# EAGLE design RGB Lanyard Driver Schematic (EAGLE 9.6.2)
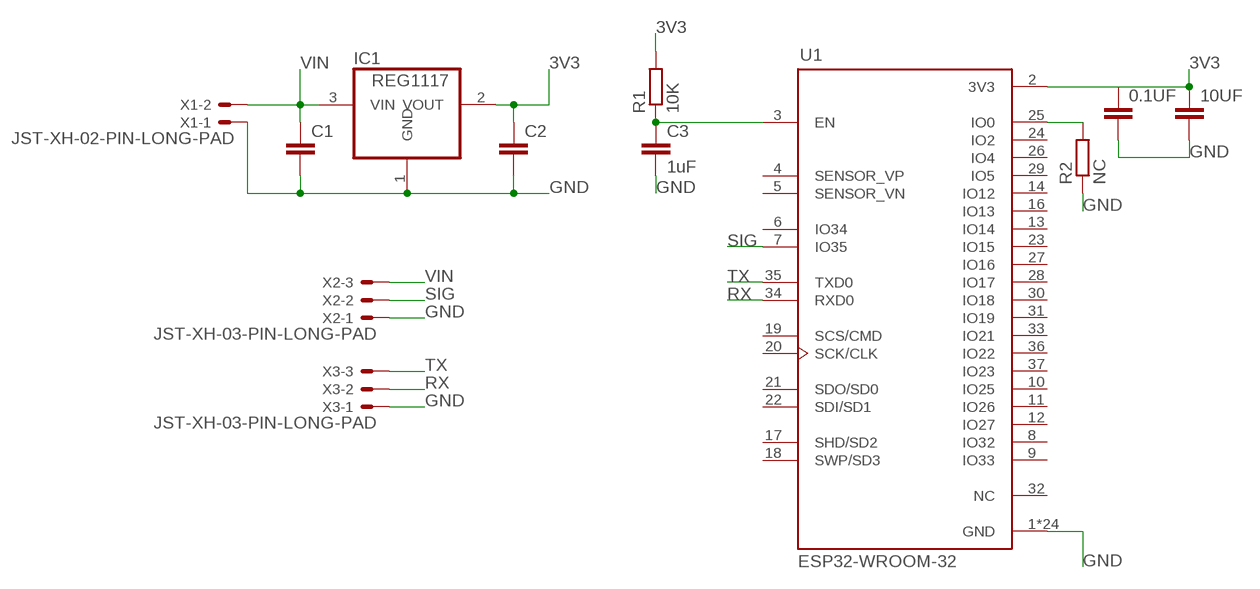
[diagram p0: schematic, sheet 1]

## Parts
0.1UF  C-EUC0805  [C0805]
10UF  C-EUC0805  [C0805]
C1  C-EUC0805  [C0805]
C2  C-EUC0805  [C0805]
C3  1uF  C-EUC0805  [C0805]
IC1  REG1117  [SOT223]
R1  10K  R-EU_R0805  [R0805]
R2  NC  R-EU_R0805  [R0805]
U1  ESP32-WROOM-32  [MODULE_ESP32-WROOM-32]
X1  JST-XH-02-PIN-LONG-PAD  [JST-XH-02-PACKAGE-LONG-PAD]
X2  JST-XH-03-PIN-LONG-PAD  [JST-XH-03-PACKAGE-LONG-PAD]
X3  JST-XH-03-PIN-LONG-PAD  [JST-XH-03-PACKAGE-LONG-PAD]

## Nets
3V3: 0.1UF.1 10UF.1 C2.1 IC1.2(VOUT) R1.2 U1.2(3V3)
GND: 0.1UF.2 10UF.2 C1.2 C2.2 C3.2 IC1.1(GND) R2.1 U1.1(GND) U1.15(GND) U1.38(GND) U1.39_1(GND) U1.39_2(GND) U1.39_3(GND) U1.39_4(GND) U1.39_5(GND) U1.39_6(GND) U1.39_7(GND) U1.39_8(GND) U1.39_9(GND) U1.39_10(GND) U1.39_11(GND) U1.39_12(GND) U1.39_13(GND) U1.39_14(GND) U1.39_15(GND) U1.39_16(GND) U1.39_17(GND) U1.39_18(GND) U1.39_19(GND) U1.39_20(GND) U1.39_21(GND) X1.1 X2.1 X3.1
N$1: C3.1 R1.1 U1.3(EN)
N$4: R2.2 U1.25(IO0)
RX: U1.34(RXD0) X3.2
SIG: U1.7(IO35) X2.2
TX: U1.35(TXD0) X3.3
VIN: C1.1 IC1.3(VIN) X1.2 X2.3
Unconnected: U1.4(SENSOR_VP) U1.5(SENSOR_VN) U1.6(IO34) U1.8(IO32) U1.9(IO33) U1.10(IO25) U1.11(IO26) U1.12(IO27) U1.13(IO14) U1.14(IO12) U1.16(IO13) U1.17(SHD/SD2) U1.18(SWP/SD3) U1.19(SCS/CMD) U1.20(SCK/CLK) U1.21(SDO/SD0) U1.22(SDI/SD1) U1.23(IO15) U1.24(IO2) U1.26(IO4) U1.27(IO16) U1.28(IO17) U1.29(IO5) U1.30(IO18) U1.31(IO19) U1.32(NC) U1.33(IO21) U1.36(IO22) U1.37(IO23)

## Library data of the parts
0.1UF 10UF C1-C3 = rcl:C-EU: CAPACITOR, European symbol; SPICEPREFIX: C
IC1 = burr-brown:REG1117: 800mA and 1A Low Dropout (LDO) Positive Regulator 1.8V, 2.5V, 2.85V, 3.3V, 5V, and Adj; MPN: REG1117; OC_FARNELL: 1097566; OC_NEWARK: 14P6981
R1 R2 = rcl:R-EU_: RESISTOR, European symbol; SPICEPREFIX: R
U1 = ESP32-WROOM-32:ESP32-WROOM-32: Check availability <https://pricing.snapeda.com/parts/ESP32-WROOM-32/Espressif%20Systems/view-part?ref=eda>; AVAILABILITY: In Stock; CHECK_PRICES: https://www.snapeda.com/parts/ESP32-WROOM-32/Espressif+Systems/view-part/?ref=eda; DESCRIPTION: Bluetooth, WiFi 802.11b/g/n, Bluetooth v4.2 +EDR, Class 1, 2 and 3 Transceiver Module 2.4GHz ~ 2.5GHz Antenna Not Included, U.FL Surface Mount; MF: Espressif Systems; MP: ESP32-WROOM-32; PACKAGE: None; PRICE: None; SNAPEDA_LINK: https://www.snapeda.com/parts/ESP32-WROOM-32/Espressif+Systems/view-part/?ref=snap
X1 = Rembrandt Electronics - JST XH Connectors v1-0:JST-XH-02-PIN: JST XH Connector 2 Pin Wire to board connector. Pitch: 2,54 mm, (0.100") Number of pins: 2 Created by Rembrandt Electronics www.rembrandtelectronics.com
X2 X3 = Rembrandt Electronics - JST XH Connectors v1-0:JST-XH-03-PIN: JST XH Connector 2 Pin Wire to board connector. Pitch: 2,54 mm, (0.100") Number of pins: 3 Created by Rembrandt Electronics www.rembrandtelectronics.com

## Board
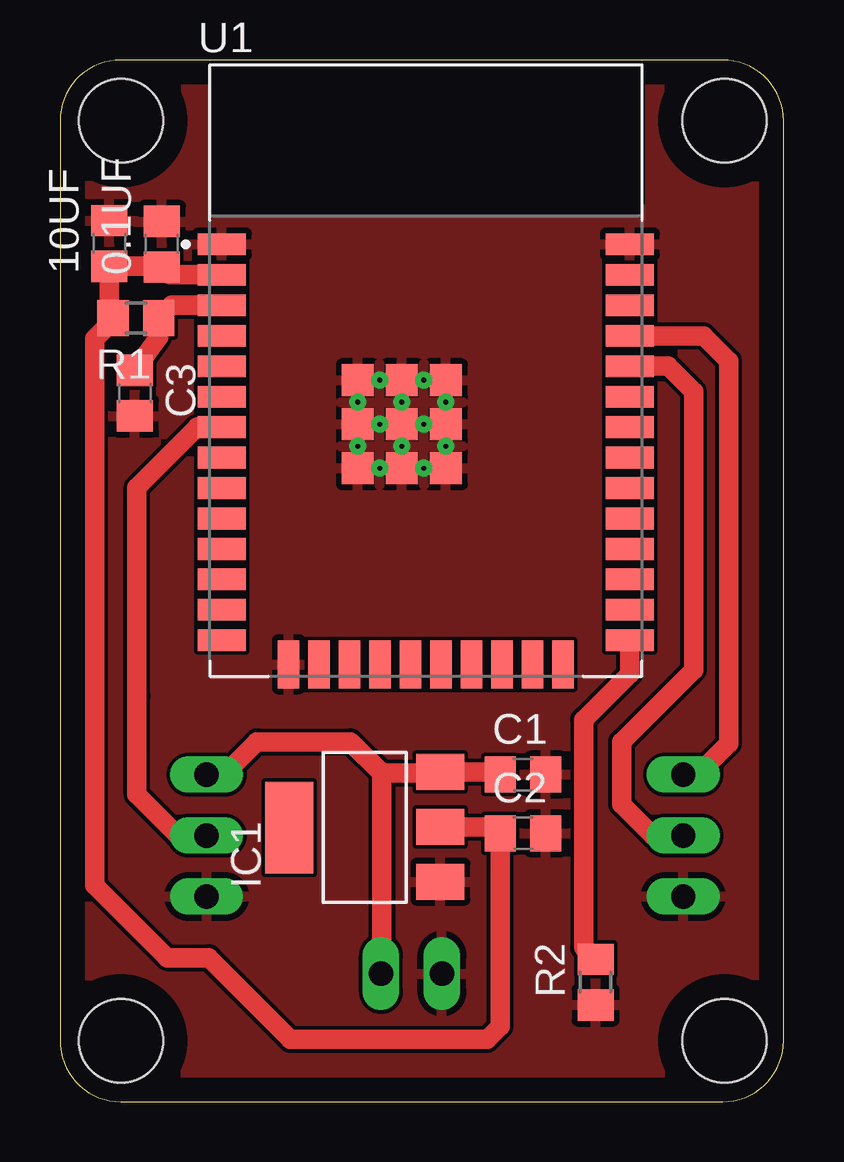
[diagram p1: board, top side]
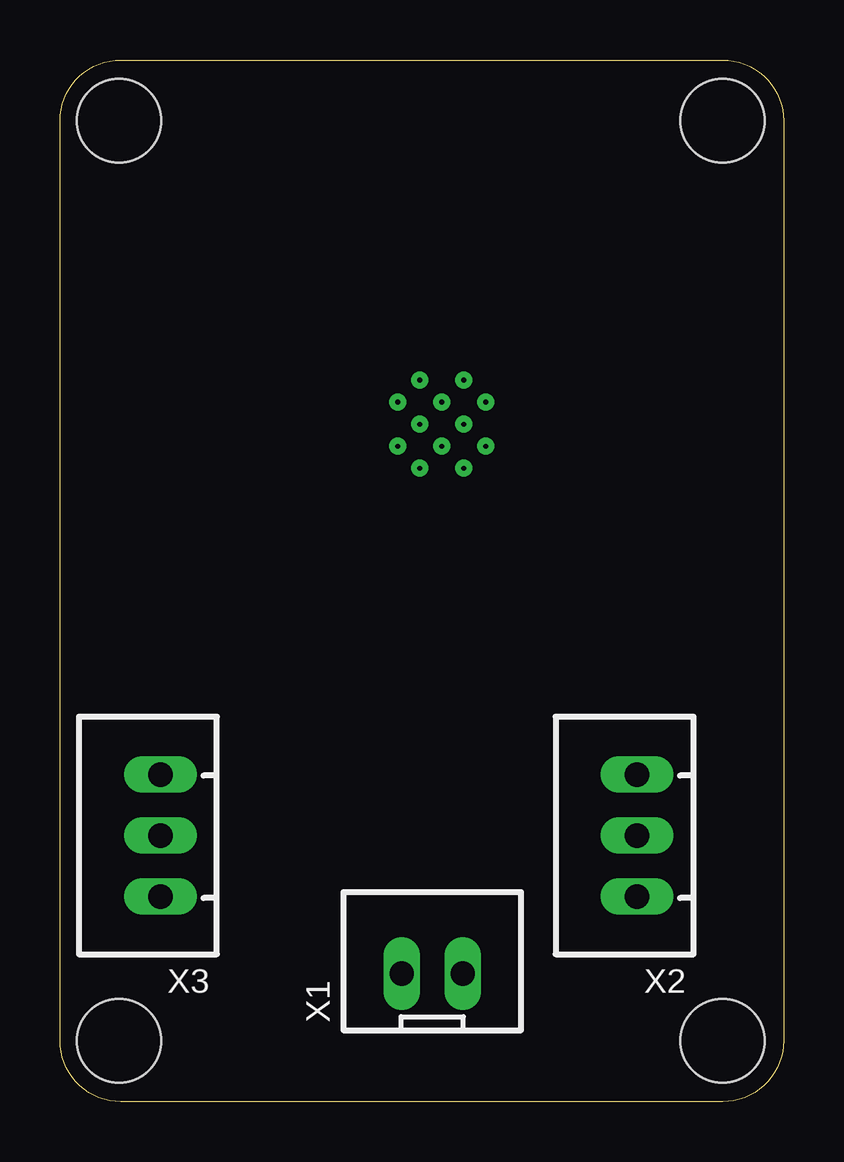
[diagram p2: board, bottom side, seen from below]

Size 30.15 x 43.42 mm. Coordinates in mm from the lower left corner, seen from the top.
Outline: 30.15,2.54 30.15,40.88 arc90 27.61,43.42 2.54,43.42 arc90 0,40.88 0,2.54 arc90 2.54,0 27.61,0 arc90 30.15,2.54
Copper layers (1*16): Top 0.035mm / dielectric 1.5mm / Bottom 0.035mm
Design rules "default": minimum track width 6mil, minimum drill 0.35mm, track to track 6mil, track to pad 6mil, pad to pad 6mil, via to via 6mil, smd to smd 6mil, copper to edge 40mil, drill to drill 6mil, minimum pad ring 10mil, minimum via ring 8mil, stop-mask expansion 4mil, vias tented up to drill 0mil, thermal gap 10mil
Holes 3.5 mm at 2.54,40.89 27.69,40.89 2.54,2.54 27.69,2.54

### Footprints (pad centres in the part's own frame; a part is rotated, then mirrored left to right if it is on the bottom)
C0805 = smd 1.3 x 1.5: 1 -0.95,0; 2 0.95,0
SOT223 = smd 1.499 x 2.007: 1 -2.261,-3.15; 2 0.025,-3.15; 3 2.311,-3.15 | smd 3.81 x 2.007: 4 0,3.15
R0805 = smd 1.3 x 1.5: 1 -0.95,0; 2 0.95,0
MODULE_ESP32-WROOM-32 = smd 2 x 0.9: 1 -8.5,5.26; 2 -8.5,3.99; 3 -8.5,2.72; 4 -8.5,1.45; 5 -8.5,0.18; 6 -8.5,-1.09; 7 -8.5,-2.36; 8 -8.5,-3.63; 9 -8.5,-4.9; 10 -8.5,-6.17; 11 -8.5,-7.44; 12 -8.5,-8.71; 13 -8.5,-9.98; 14 -8.5,-11.25; 25 8.5,-11.25; 26 8.5,-9.98; 27 8.5,-8.71; 28 8.5,-7.44; 29 8.5,-6.17; 30 8.5,-4.9; 31 8.5,-3.63; 32 8.5,-2.36; 33 8.5,-1.09; 34 8.5,0.18; 35 8.5,1.45; 36 8.5,2.72; 37 8.5,3.99; 38 8.5,5.26 | smd 0.9 x 2: 15 -5.715,-12.25; 16 -4.445,-12.25; 17 -3.175,-12.25; 18 -1.905,-12.25; 19 -0.635,-12.25; 20 0.635,-12.25; 21 1.905,-12.25; 22 3.175,-12.25; 23 4.445,-12.25; 24 5.715,-12.25 | smd 1.33 x 1.33: 39_1 -2.835,-0.405; 39_2 -1,-0.405; 39_3 0.835,-0.405; 39_4 -2.835,-2.24; 39_5 -1,-2.24; 39_6 0.835,-2.24; 39_7 -2.835,-4.075; 39_8 -1,-4.075; 39_9 0.835,-4.075 | drill 0.2 pad 0.3: 39_10 -1.917,-0.405; 39_11 -0.083,-0.405; 39_12 -2.835,-1.323; 39_13 -1,-1.323; 39_14 0.835,-1.323; 39_15 -1.917,-2.24; 39_16 -0.083,-2.24; 39_17 -2.835,-3.158; 39_18 -1,-3.158; 39_19 0.835,-3.158; 39_20 -1.917,-4.075; 39_21 -0.083,-4.075
JST-XH-02-PACKAGE-LONG-PAD = drill 1.016 long: 1 -1.27,0; 2 1.27,0
JST-XH-03-PACKAGE-LONG-PAD = drill 1.016 long: 1 -2.54,0; 2 0,0; 3 2.54,0

### Placement (x,y rotation side)
0.1UF  4.24,35.74 90 top
10UF  2.06,35.77 90 top
C1  19.29,13.63 0 top
C2  19.29,11.19 0 top
C3  3.12,29.54 270 top
IC1  12.7,11.43 90 top
R1  3.16,32.66 180 top
R2  22.31,4.98 90 top
U1  15.24,30.48 0 top
X1  14.64,5.34 0 bottom
X2  6.11,11.1 90 bottom
X3  25.97,11.1 90 bottom

### Tracks (layer width: path | path; a pad name or v marks a point on that pad's centre or on a via)
3V3
  Top 0.254: 4.8,34.47 4.72,34.55
  Top 0.406: 10UF.1 2.03,34.82
  Top 0.508: 4.8,34.47 5.3,34.47 | 18.07,11.46 C2.1 | R1.2 2.06,33.07 | 10UF.1 | 4.56,34.47 0.1UF.1
  Top 0.813: U1.2 5.3,34.47 4.56,34.47 | IC1.2 18.07,11.46 | C2.1 18.34,3.14 17.8,2.6 9.6,2.6 6.2,6 4.48,6 1.45,9.03 1.45,31.81 2.21,32.56 R1.2 | 2.06,33.07 10UF.1 4.21,34.82 0.1UF.1
GND
  pour Top: -0.1,43.5 6,43.5 6,37.2 24.6,37.2 24.6,37.4 24.6,43.2 24.9,43.2 30.4,43.2 30.4,0.4 30.4,0 0.1,0 -0.1,0
N$1
  Top 0.61: R1.1 4.11,31.88
  Top 0.813: 4.11,31.88 C3.1 | R1.1 4.65,33.2 U1.3
N$4
  Top 0.61: R2.2 21.81,6.43
  Top 0.813: 21.81,6.43 21.81,15.91 23.74,17.84 U1.25
RX
  Top 0.813: X3.2 24.7,11.1 23.4,12.4 23.4,15 26.4,18 26.4,29.6 25.34,30.66 U1.34
SIG
  Top 0.813: U1.7 5.72,28.12 3.2,25.6 3.2,16.9 3.2,12.8 4.91,11.1 X2.2
TX
  Top 0.508: 23.75,31.92 U1.35
  Top 0.813: X3.3 26.57,13.63 27.86,14.93 27.86,30.87 26.82,31.92 23.75,31.92
VIN
  Top 0.406: 13.4,5.37 X1.2
  Top 0.508: 15.81,13.7 IC1.3 | 18.23,13.74 C1.1
  Top 0.813: 13.4,13.7 12.1,15 8.2,15 6.83,13.63 X2.3 | 13.4,13.7 15.81,13.7 | IC1.3 18.23,13.74 | 13.4,13.7 13.4,5.37